# EAGLE schematic inverted-f_with_mmcx (EAGLE 6.5.0)
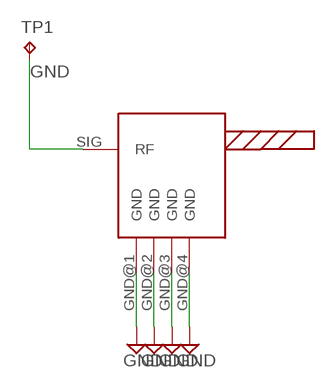
[diagram p0: schematic, sheet 1]

## Parts
J1  MMCX-J-P-X-RA-SM1SMD  [MMCX-J-P-X-RA-SM1_SAMTEC]
TP1  TPTP10SQ  [TP10SQ]

## Nets
GND: J1.GND@1(GND) J1.GND@2(GND) J1.GND@3(GND) J1.GND@4(GND) J1.SIG(RF) TP1.TP

## Library data of the parts
J1 = 195Ec_300-0004-01_rev1_b:MMCX-J-P-X-RA-SM1
TP1 = testpad:TP: Test pad